# EasyEDA Pro project RH Light House.epro

# Schematic Schematic1
Board Name: Board1; Create Date: 2025-12-14; Page Name: P1; Project Name: RH Light House; Schematic Name: Schematic1; Update Date: 2025-12-22; Company: EasyEDA.com; Page Size: A4; Version: V1.0
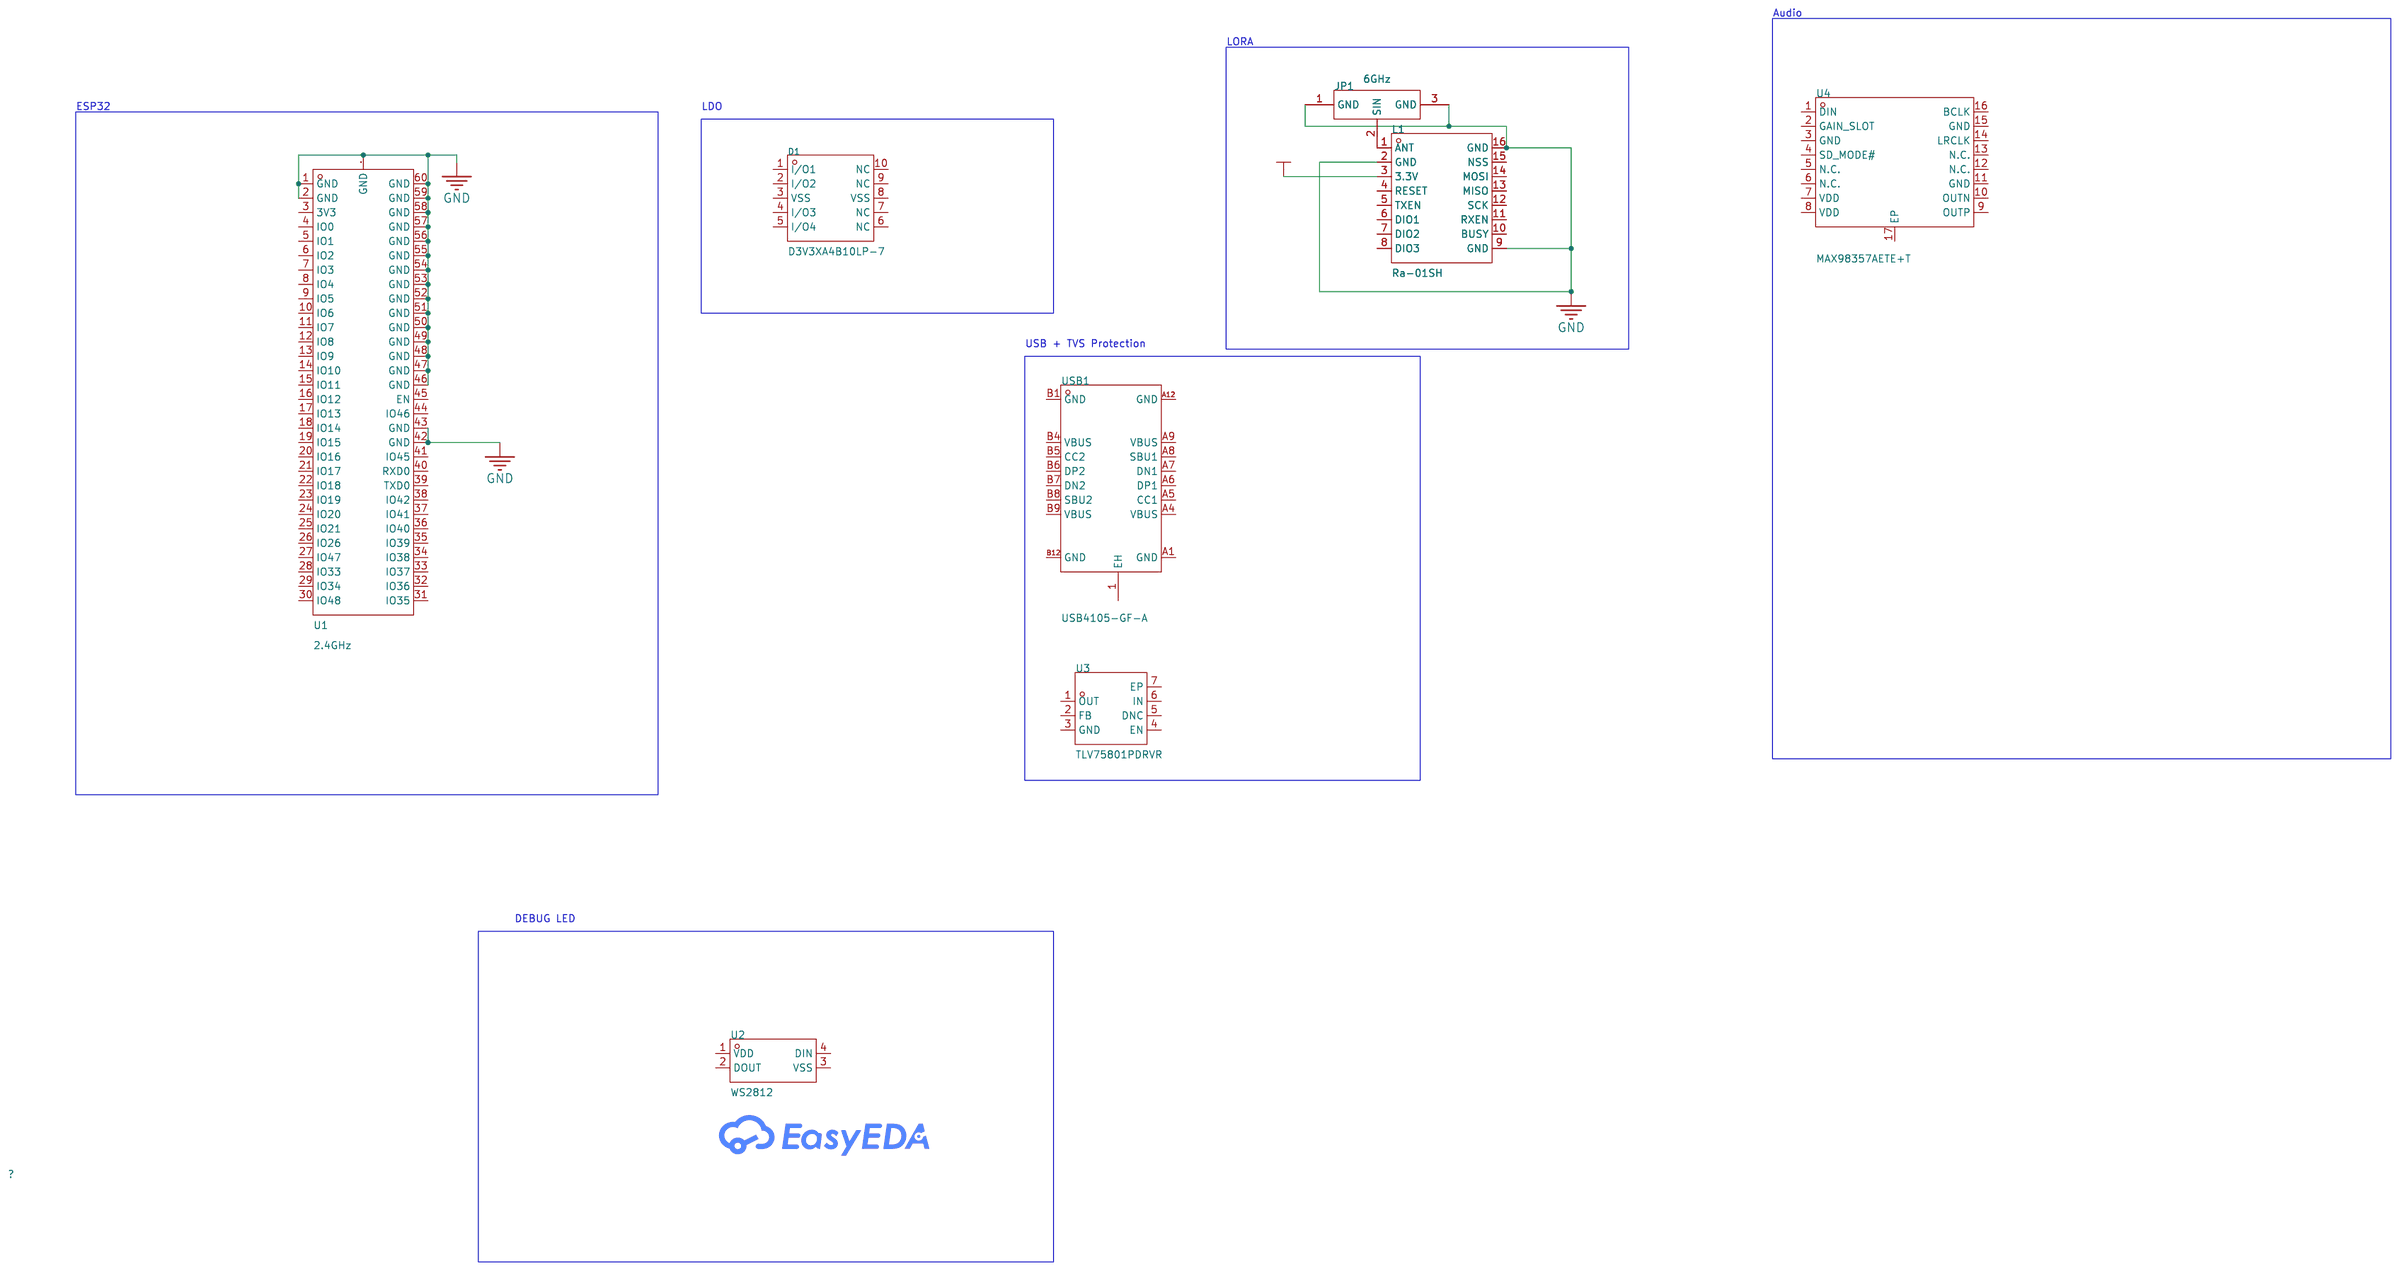
[diagram p0: schematic sheet]

## Parts
D1  D3V3XA4B10LP-7  [U-DFN2510-10_L2.5-W1.0-P0.50-BL]
JP1  6GHz  [ANT-SMD_UFL-R-SMT-1-10]
L1  Ra-01SH  [WIRELM-SMD_RA-01SH]
U1  2.4GHz  [BULETM-SMD_ESP32-S3-MINI-1-N8]
U2  WS2812  [LED-SMD_4P-L5.0-W5.0-TL-A]
U3  TLV75801PDRVR  [WSON-6_L2.0-W2.0-P0.65-TL-EP]
U4  MAX98357AETE+T  [TQFN-16_L3.0-W3.0-P0.50-BL-EP1.5]
USB1  USB4105-GF-A  [TYPE-C-SMD_SBC-160S1A-20-S412]

## Library data of the parts
D1 = D3V3XA4B10LP-7: Reverse Stand-Off Voltage (Vrwm):3.3V Maximum Clamping Voltage:9.4V Peak Pulse Current (Ipp)@10/1000us:4A@(8/20us) Peak Pulse Power Dissipation (Ppp)@10/1000us:24W Breakdown Voltage:5V Number of Lines:Quad Operating Temperature:-55℃~+150℃@(Tj) Operating T; Supplier Part: C1980462; Manufacturer: DIODES(美台); Supplier Footprint: UDFN2510-10; JLCPCB Part Class: Extended Part; Datasheet: https://atta.szlcsc.com/upload/public/pdf/source/20210612/4E7C5813EAA5EA71D504F2B0FA5443D6.pdf; Supplier: LCSC; Reverse Stand-Off Voltage (Vrwm): 3.3V; Maximum Clamping Voltage: 9.4V; Peak Pulse Current (Ipp)@10/1000us: 4A@(8/20us); Peak Pulse Power Dissipation (Ppp)@10/1000us: 24W; Breakdown Voltage: 5V; Number of Lines: Quad; Operating Temperature: -55℃~+150℃@(Tj); Type: ESD
JP1 = U.FL-R-SMT-1(10): Connector Type:Board Side Interface:Male Pin Number of Ports:1 Interface Diameter:2mm Interface Length/Height:1.25mm Frequency:6GHz RF Series:IPEX Impedance:50Ω Style:- Operating Temperature Range:-40℃~+90℃ Operating Temperature Range:-40℃~+90℃; LCSC Part Name: IPEX 内针; Supplier Part: C88373; Manufacturer: HRS(广濑); Supplier Footprint: SMD; JLCPCB Part Class: Extended Part; Datasheet: https://item.szlcsc.com/datasheet/U.FL-R-SMT-1(10)/89552.html; Supplier: LCSC; Connector Type: Board Side; Interface: Male Pin; Number of Ports: 1; Interface Diameter: 2mm; Interface Length/Height: 1.25mm; RF Series: IPEX; Impedance: 50Ω; Operating Temperature Range: -40℃~+90℃
L1 = Ra-01SH: Output Power:22dBm Output Power:22dBm Support Interface:SPI Modulation System:LoRa；OOK；MSK；GFSK；FSK；GMSK Operating Voltage:3.3V Operating Voltage:3.3V Antenna Type:IPEX Interface Receive  Current:4.2mA Send  Current:140mA Sensitivity:-148dBm Sensitivity:-; LCSC Part Name: LoRa模组 Ra-01SH; Supplier Part: C2764087; Manufacturer: Ai-Thinker(安信可); Supplier Footprint: SMD-16P; JLCPCB Part Class: Extended Part; Datasheet: https://atta.szlcsc.com/upload/public/pdf/source/20210401/C2764087_37E80225C9871B7445E5F231DF1A9FD5.pdf; Supplier: LCSC; Output Power: 22dBm; Support Interface: SPI; Modulation System: LoRa；OOK；MSK；GFSK；FSK；GMSK; Operating Voltage: 3.3V; Antenna Type: IPEX Interface; Receive  Current: 4.2mA; Send  Current: 140mA; Sensitivity: -148dBm; Operating Temperature: -40℃~+85℃
U1 = ESP32-S3-MINI-1-N8: Core Processor:ESP32-S3FN8 Chip Wireless Standard:- Support Interface:I2C；GPIO；SPI；PWM；ADC；UART；USB；I2S Frequency:2.4GHz Antenna Type:- Output Power:20.5dBm Output Power:20.5dBm Operating Voltage:- Operating Voltage:- Receive  Current:- Send  Current:- Se; Supplier Part: C2913206; Manufacturer: ESPRESSIF(乐鑫); Supplier Footprint: SMD; JLCPCB Part Class: Extended Part; Datasheet: https://atta.szlcsc.com/upload/public/pdf/source/20220425/7F117D7A09F85946280540FD9EFDF9F3.pdf; Supplier: LCSC; Core Processor: ESP32-S3FN8 Chip; Support Interface: I2C；GPIO；SPI；PWM；ADC；UART；USB；I2S; Output Power: 20.5dBm
U2 = WS2812: Supplier Part: C42417498; Manufacturer: worldsemi; Supplier Footprint: SMD5050-4P; JLCPCB Part Class: Extended Part; Datasheet: https://item.szlcsc.com/datasheet/WS2812/44423158.html; Supplier: LCSC
U3 = TLV75801PDRVR: Output Type:Adjustable Maximum Input Voltage:6V Output Voltage:550mV~5.5V Output Voltage:550mV~5.5V Output Current:500mA Dropout Voltage:880mV@(500mA) standby current:31uA Feature:防静电保护；Soft Start；Short-Circuit  Protection；自动放电功能；低ESR；Thermal Protection(T; LCSC Part Name: 具有使能功能的 500mA、低 IQ、高精度、可调节超低压降稳压器; Supplier Part: C2876308; Manufacturer: TI(德州仪器); Supplier Footprint: WSON-6-EP(2x2); JLCPCB Part Class: Extended Part; Datasheet: https://www.ti.com/cn/lit/gpn/tlv758p; Supplier: LCSC; Output Type: Adjustable; Maximum Input Voltage: 6V; Output Voltage: 550mV~5.5V; Output Current: 500mA; Dropout Voltage: 880mV@(500mA); standby current: 31uA; Feature: 防静电保护；Soft Start；Short-Circuit  Protection；自动放电功能；低ESR；Thermal Protection(TSD)；欠压闭锁；Overcurrent Protection(OCP)；带使能；防倒灌; Operating Temperature: -40℃~+125℃@(Tj); Output Polarity: Positive electrode; Number of Outputs: 1
U4 = MAX98357AETE+T: Class:Class D Speaker Channels:- Output Power:3.2W×1@4Ω Voltage - Supply:2.5V~5.5V Voltage - Supply:2.5V~5.5V Total Harmonic Distortion + Noise (THD+N):- Quiescent Current:2.4mA Operating Temperature:-40℃~+85℃ Operating Temperature:-40℃~+85℃ Power Supply; LCSC Part Name: 微型、低成本、PCM 类 D 级放大器具有 AB 级性能; Supplier Part: C910544; Manufacturer: ADI(亚德诺)/MAXIM(美信); Supplier Footprint: TQFN-16-EP(3x3); JLCPCB Part Class: Extended Part; Datasheet: https://item.szlcsc.com/datasheet/MAX98357AETE%252BT/978950.html; Supplier: LCSC; Class: Class D; Output Power: 3.2W×1@4Ω; Voltage - Supply: 2.5V~5.5V; Quiescent Current: 2.4mA; Operating Temperature: -40℃~+85℃; Power Supply Rejection Ratio (PSRR): 77dB; Efficiency: 92%
USB1 = USB4105-GF-A: Supplier Part: C3020560; Manufacturer: GCT; Supplier Footprint: SMD; JLCPCB Part Class: Extended Part; Datasheet: https://item.szlcsc.com/datasheet/USB4105-GF-A/3542626.html; Supplier: LCSC

## Nets
+3V3: L1.3(3.3V)
GND: JP1.1(GND) JP1.3(GND) L1.2(GND) L1.9(GND) L1.16(GND) U1.1(GND) U1.2(GND) U1.42(GND) U1.43(GND) U1.46(GND) U1.47(GND) U1.48(GND) U1.49(GND) U1.50(GND) U1.51(GND) U1.52(GND) U1.53(GND) U1.54(GND) U1.55(GND) U1.56(GND) U1.57(GND) U1.58(GND) U1.59(GND) U1.60(GND) U1.GND
Net-(JP1-2): JP1.2(SIN) L1.1(ANT)

Not connected (* = marked no-connect by the designer): D1 1(I/O1) 2(I/O2) 3(VSS) 4(I/O3) 5(I/O4) 6(NC) 7(NC) 8(VSS) 9(NC) 10(NC); L1 4(RESET) 5(TXEN) 6(DIO1) 7(DIO2) 8(DIO3) 10(BUSY) 11(RXEN) 12(SCK) 13(MISO) 14(MOSI) 15(NSS); U1 3(3V3) 4(IO0) 5(IO1) 6(IO2) 7(IO3) 8(IO4) 9(IO5) 10(IO6) 11(IO7) 12(IO8) 13(IO9) 14(IO10) 15(IO11) 16(IO12) 17(IO13) 18(IO14) 19(IO15) 20(IO16) 21(IO17) 22(IO18) 23(IO19) 24(IO20) 25(IO21) 26(IO26) 27(IO47) 28(IO33) 29(IO34) 30(IO48) 31(IO35) 32(IO36) 33(IO37) 34(IO38) 35(IO39) 36(IO40) 37(IO41) 38(IO42) 39(TXD0) 40(RXD0) 41(IO45) 44(IO46) 45(EN); U2 1(VDD) 2(DOUT) 3(VSS) 4(DIN); U3 1(OUT) 2(FB) 3(GND) 4(EN) 5(DNC) 6(IN) 7(EP); U4 1(DIN) 2(GAIN_SLOT) 3(GND) 4(SD_MODE#) 5(N.C.) 6(N.C.) 7(VDD) 8(VDD) 9(OUTP) 10(OUTN) 11(GND) 12(N.C.) 13(N.C.) 14(LRCLK) 15(GND) 16(BCLK) 17(EP); USB1 1(EH) A1(GND) A4(VBUS) A5(CC1) A6(DP1) A7(DN1) A8(SBU1) A9(VBUS) A12(GND) B1(GND) B4(VBUS) B5(CC2) B6(DP2) B7(DN2) B8(SBU2) B9(VBUS) B12(GND)

## Notes on the sheet
- Audio
- LORA
- ESP32
- LDO
- USB + TVS Protection
- DEBUG LED

# Board PCB1
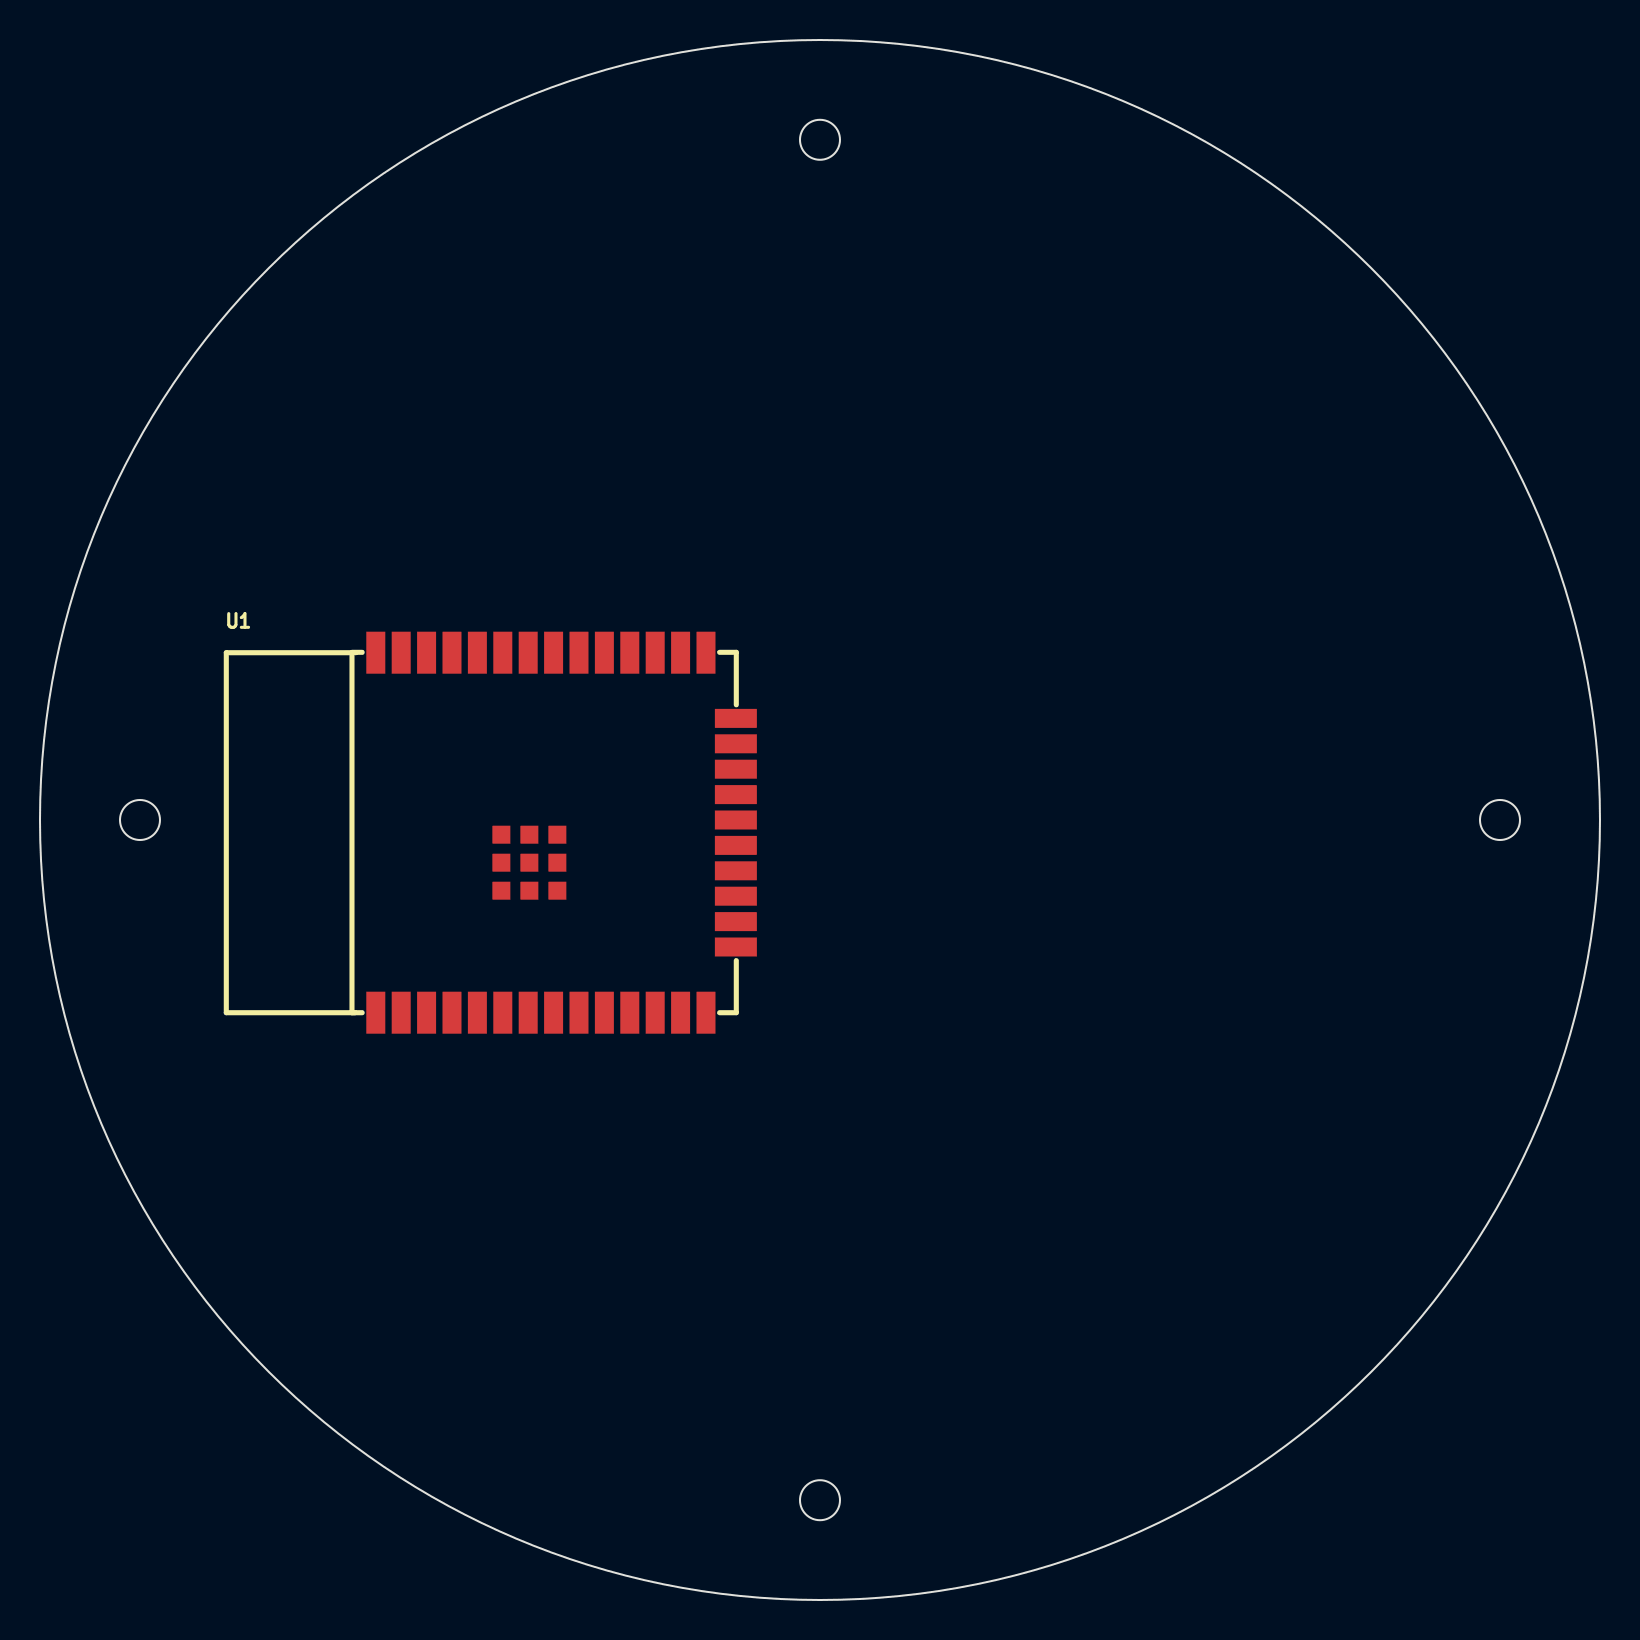
[diagram p1: board, top side]
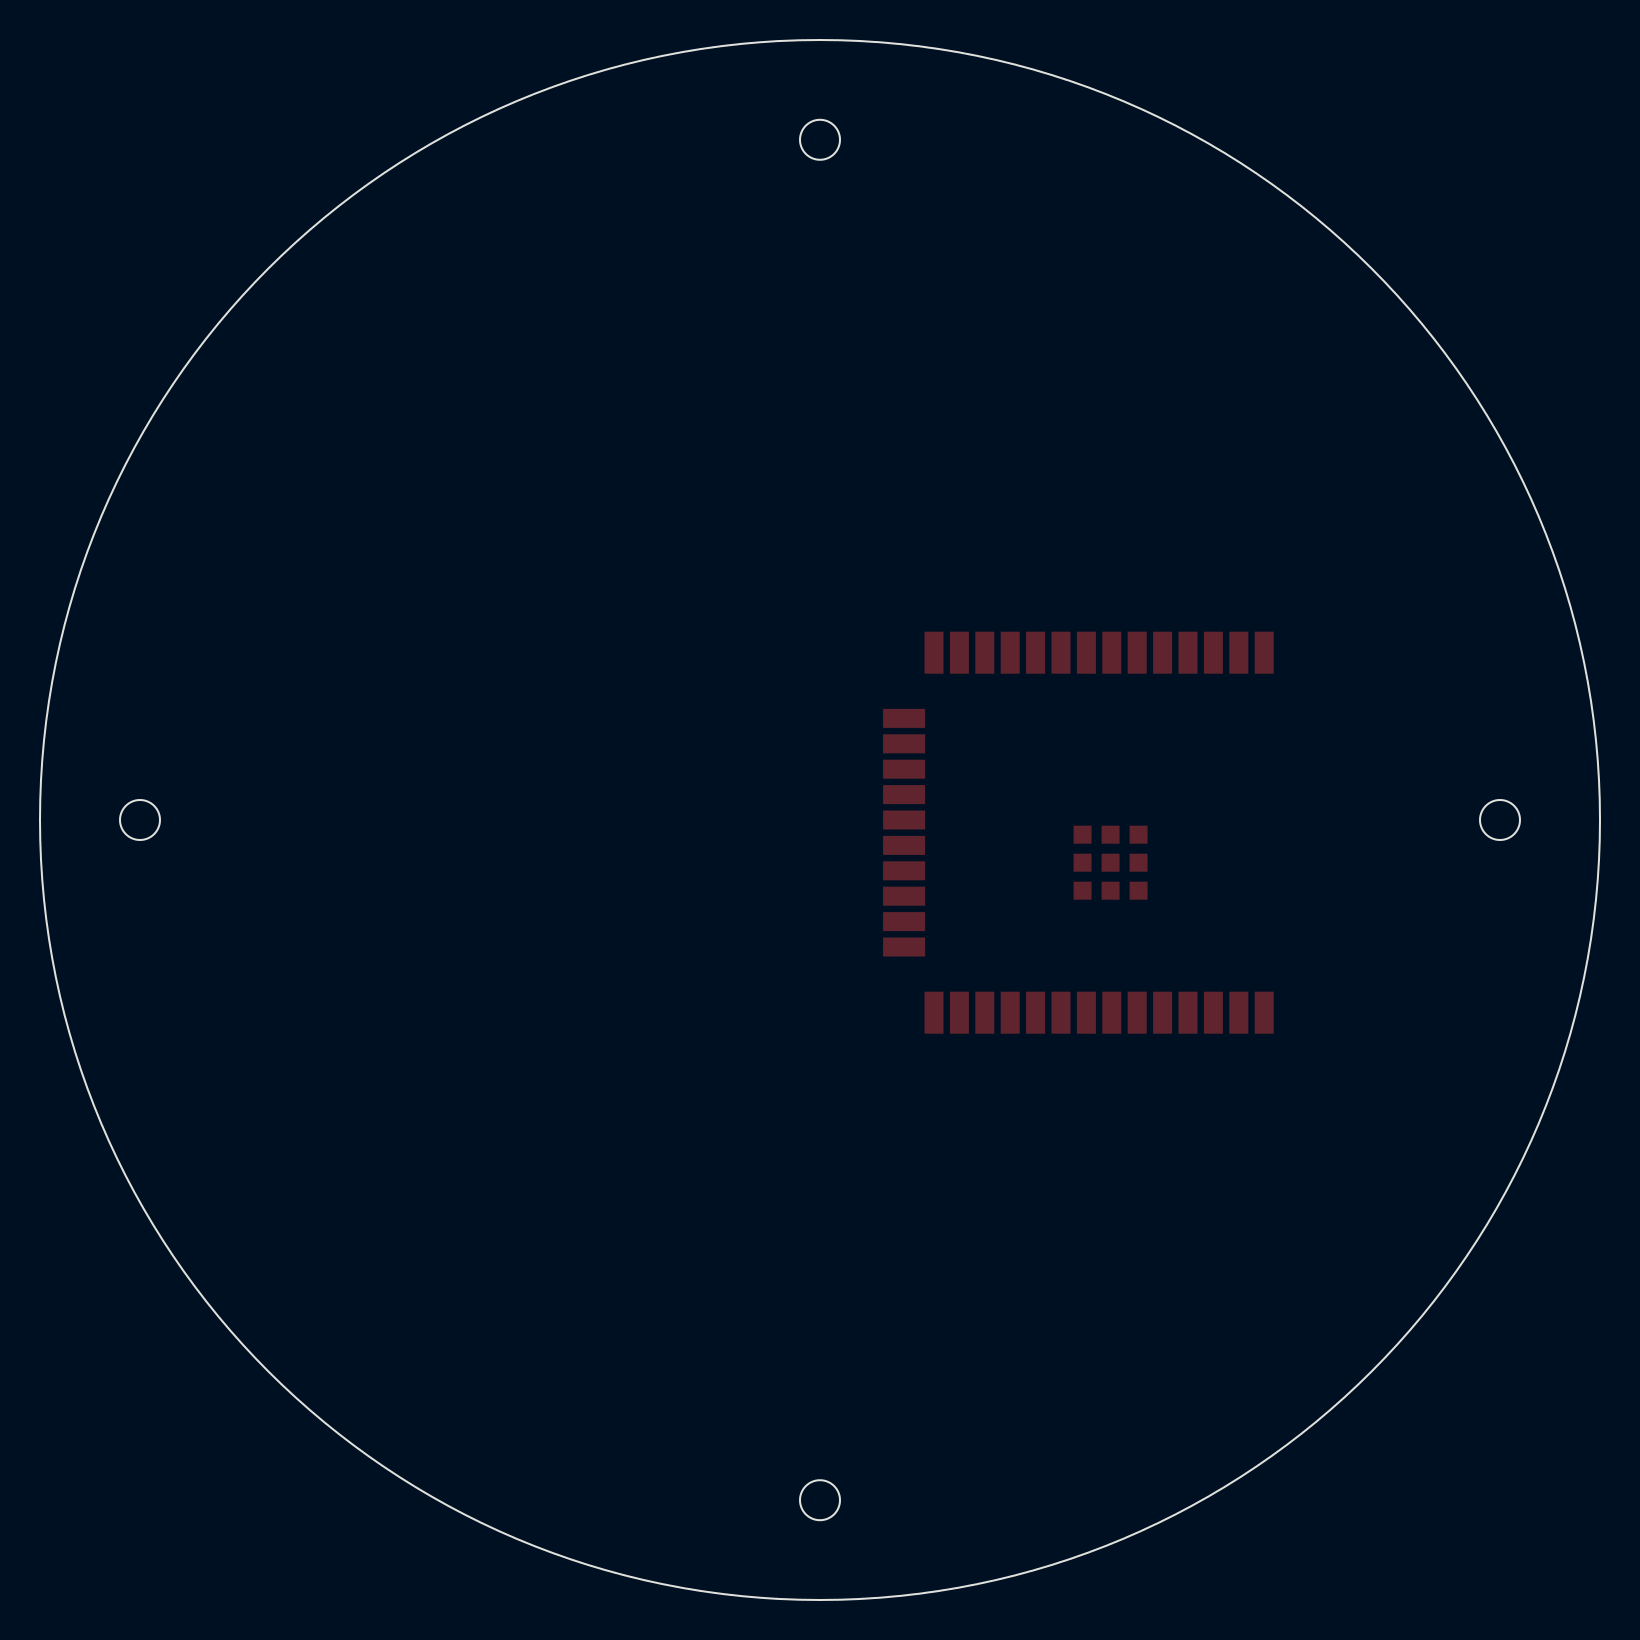
[diagram p2: board, bottom side, seen from below]

Outline 78 x 78 mm; copper layers: Top Layer, Bottom Layer. Coordinates in mm from the lower left corner of the outline.
Outline path: circle c5,39 r1 ; circle c39,73.01 r1 ; circle c39,39 r39 ; circle c39,4.99 r1 ; circle c73,39 r1
Stack: Top Layer 0.035mm / Dielectric1 1.51mm FR4 er 4.5 / Bottom Layer 0.035mm

## Design rules (mm)
template: JLCPCB Capability(Two Layers Board)
spacing copperThickness1oz (default): track to track 0.102, other pairs 0.152 to 0.3
spacing copperThickness2oz: track to track 0.203, other pairs 0.152 to 0.3
track width copperThickness1oz (default): min 0.127, default 0.254, max 2.54
track width copperThickness2oz: min 0.203, default 0.254, max 2.54
differential pair differentialPair (default): width min 0.127, default 0.254, max 2.54; gap min 0.152, default 0.152
via viaSize (default): diameter min 0.5, default 0.61, max 10; hole min 0.3, default 0.305, max 6.3

## Placement (name value [footprint] x y rotation side)
U1  2.4GHz  [WIFI-SMD_ESP32-WROOM-32E]  25.79 38.36 0 top

## Footprints (pads in the part's own frame, mm; a bottom-side part is the same pattern mirrored in y, then rotated)
WIFI-SMD_ESP32-WROOM-32E
  rect 0.95x2.1 smd: 1(-9.002,-9) 2(-7.732,-9) 3(-6.463,-9) 4(-5.192,-9) 5(-3.922,-9) 6(-2.652,-9) 7(-1.383,-9) 8(-0.113,-9) 9(1.157,-9) 10(2.428,-9) 11(3.697,-9) 12(4.968,-9) 13(6.237,-9) 14(7.508,-9) 25(7.508,9) 26(6.237,9) 27(4.968,9) 28(3.697,9) 29(2.428,9) 30(1.157,9) 31(-0.113,9) 32(-1.383,9) 33(-2.652,9) 34(-3.922,9) 35(-5.192,9) 36(-6.463,9) 37(-7.732,9) 38(-9.002,9)
  rect 2.1x0.95 smd: 15(9.002,-5.715) 16(9.002,-4.445) 17(9.002,-3.175) 18(9.002,-1.905) 19(9.002,-0.635) 20(9.002,0.635) 21(9.002,1.905) 22(9.002,3.175) 23(9.002,4.445) 24(9.002,5.715)
  rect 0.9x0.9 smd: 39(-2.721,-0.1) 39(-2.721,-1.5) 39(-2.721,-2.9) 39(-1.321,-0.1) 39(-1.321,-1.5) 39(-1.321,-2.9) 39(0.079,-0.1) 39(0.079,-1.5) 39(0.079,-2.9)

## Nets
As in the schematic.

Pads without a net: U1 1 2 3 4 5 6 7 8 9 10 11 12 13 14 15 16 17 18 19 20 21 22 23 24 25 26 27 28 29 30 31 32 33 34 35 36 37 38 39
